# EAGLE design pqar-wirebonded-rev1 (EAGLE 9.2.2)
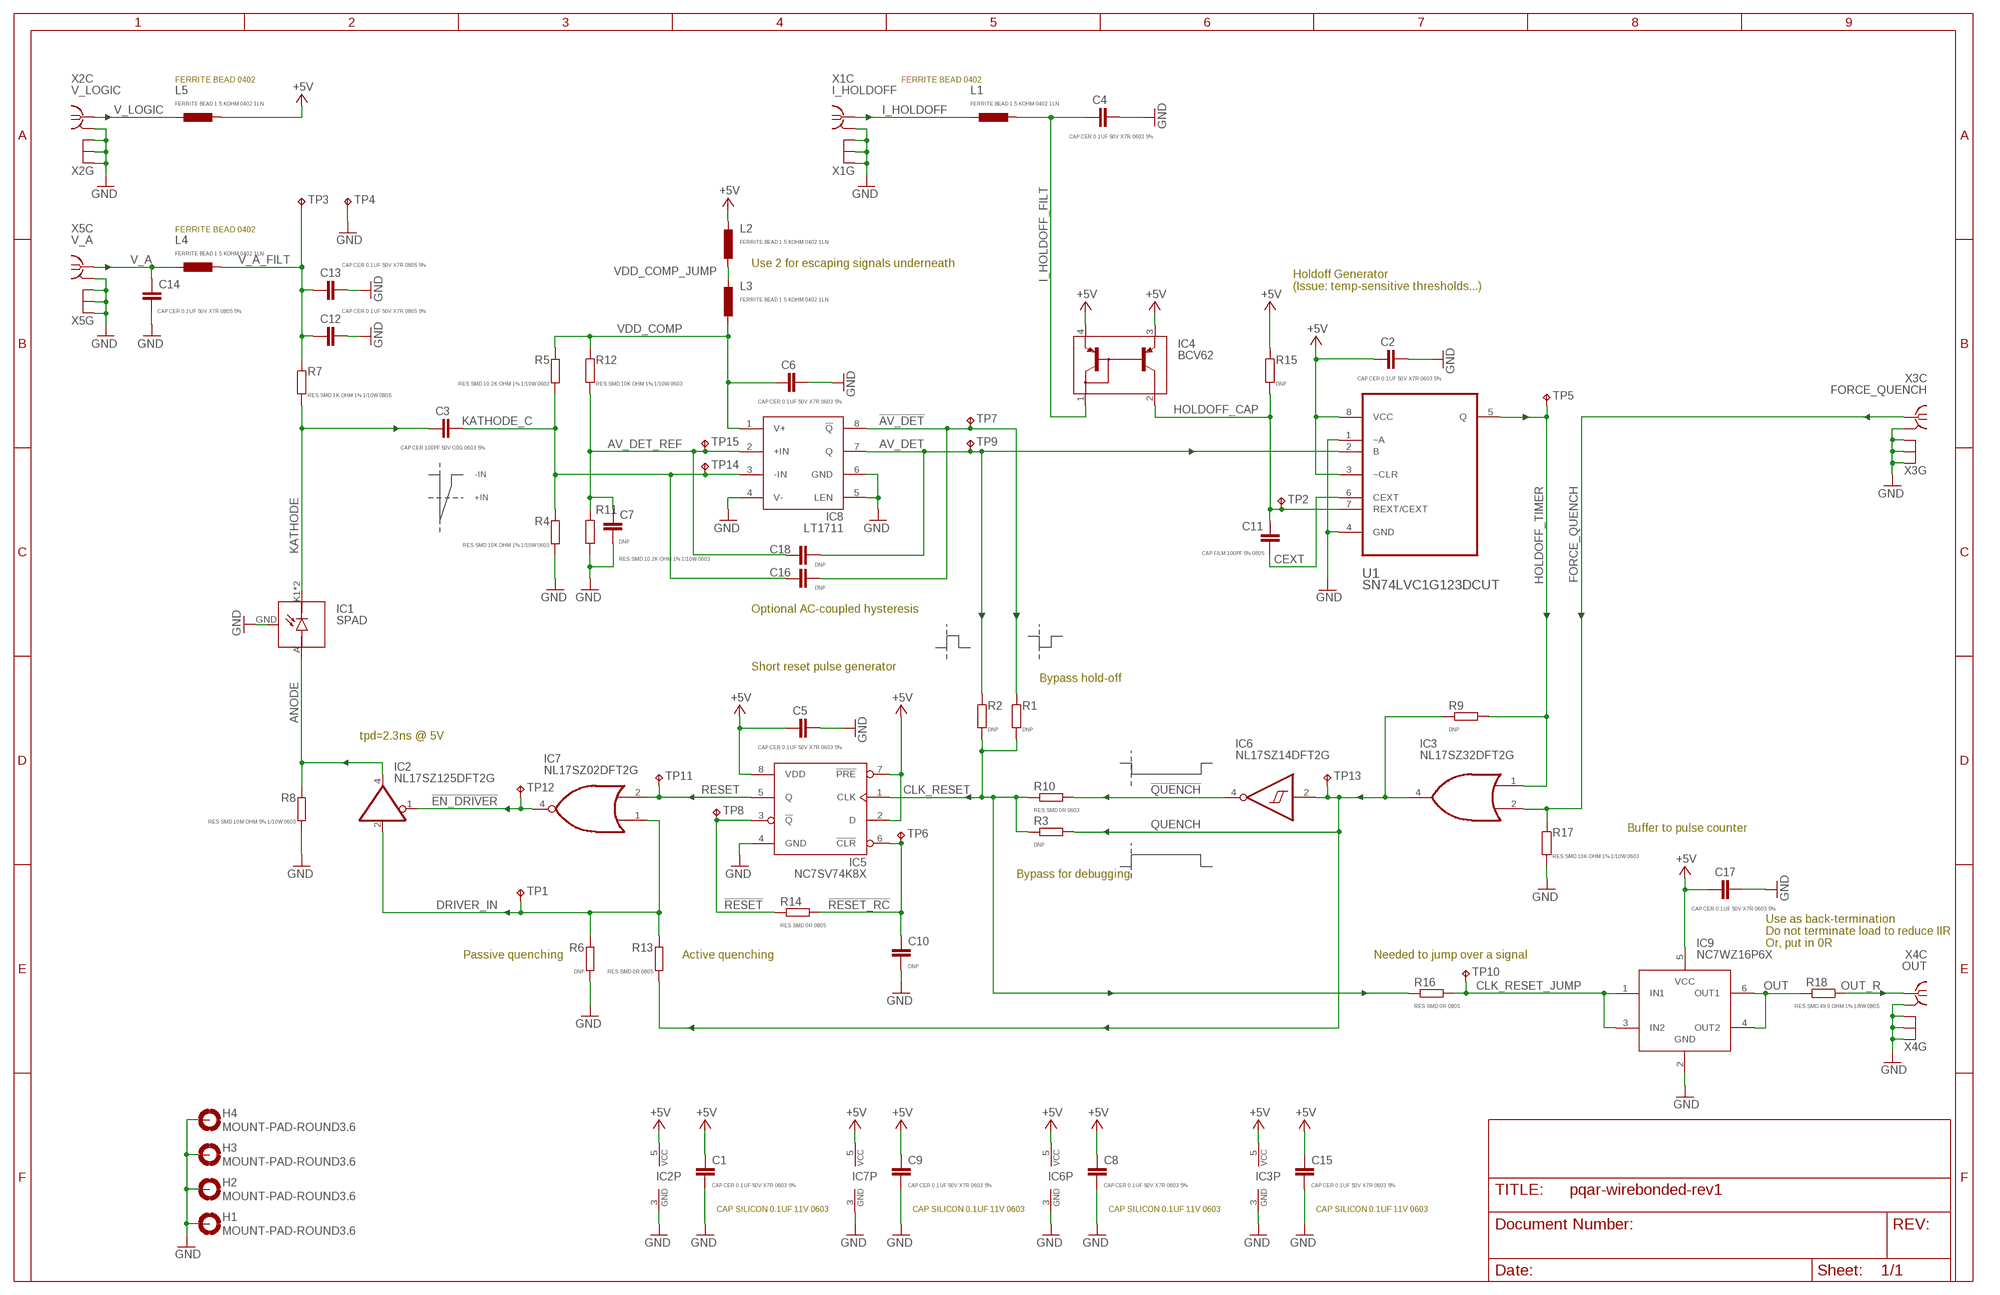
[diagram p0: schematic, sheet 1]

## Parts
C1  CAP CER 0.1UF 50V X7R 0603 5%  C-EUC0603  [C0603]
C2  CAP CER 0.1UF 50V X7R 0603 5%  C-EUC0603  [C0603]
C3  CAP CER 100PF 50V C0G 0603 5%  C-EUC0603  [C0603]
C4  CAP CER 0.1UF 50V X7R 0603 5%  C-EUC0603  [C0603]
C5  CAP CER 0.1UF 50V X7R 0603 5%  C-EUC0603  [C0603]
C6  CAP CER 0.1UF 50V X7R 0603 5%  C-EUC0603  [C0603]
C7  DNP  C-EUC0603  [C0603]
C8  CAP CER 0.1UF 50V X7R 0603 5%  C-EUC0603  [C0603]
C9  CAP CER 0.1UF 50V X7R 0603 5%  C-EUC0603  [C0603]
C10  DNP  C-EUC0805  [C0805]
C11  CAP FILM 100PF 5% 0805  C-EUC0805  [C0805]
C12  CAP CER 0.1UF 50V X7R 0805 5%  C-EUC0805  [C0805]
C13  CAP CER 0.1UF 50V X7R 0805 5%  C-EUC0805  [C0805]
C14  CAP CER 0.1UF 50V X7R 0805 5%  C-EUC0805  [C0805]
C15  CAP CER 0.1UF 50V X7R 0603 5%  C-EUC0603  [C0603]
C16  DNP  C-EUC0805  [C0805]
C17  CAP CER 0.1UF 50V X7R 0603 5%  C-EUC0603  [C0603]
C18  DNP  C-EUC0805  [C0805]
H1  MOUNT-PAD-ROUND3.6  [3,6-PAD]
H2  MOUNT-PAD-ROUND3.6  [3,6-PAD]
H3  MOUNT-PAD-ROUND3.6  [3,6-PAD]
H4  MOUNT-PAD-ROUND3.6  [3,6-PAD]
IC1  SPAD  SPAD-GENERIC  [SPAD-WIREBOND-GENERIC-CRYO]
IC2  NL17SZ125DFT2G  74AHC1G125DCK  [SC70-5]
IC3  NL17SZ32DFT2G  74AUC1G32DCK  [SC70-5]
IC4  BCV62  [SOT143B]
IC5  NC7SV74K8X  [US8_3.1MM_JDEC_MO-187]
IC6  NL17SZ14DFT2G  74AHC1G14DCK  [SC70-5]
IC7  NL17SZ02DFT2G  74LVC1G02DCK  [SC70-5]
IC8  LT1711  LTC1711  [MSOP8]
IC9  NC7WZ16P6X  [SC70-6L]
L1  FERRITE BEAD 1.5 KOHM 0402 1LN  INDUCTOR0402  [R0402]
L2  FERRITE BEAD 1.5 KOHM 0402 1LN  INDUCTOR0402  [R0402]
L3  FERRITE BEAD 1.5 KOHM 0402 1LN  INDUCTOR0402  [R0402]
L4  FERRITE BEAD 1.5 KOHM 0402 1LN  INDUCTOR0402  [R0402]
L5  FERRITE BEAD 1.5 KOHM 0402 1LN  INDUCTOR0402  [R0402]
R1  DNP  R-EU_R0805  [R0805]
R2  DNP  R-EU_R0805  [R0805]
R3  DNP  R-EU_R0603  [R0603]
R4  RES SMD 10K OHM 1% 1/10W 0603  R-EU_R0603  [R0603]
R5  RES SMD 10.2K OHM 1% 1/10W 0603  R-EU_R0603  [R0603]
R6  DNP  R-EU_R0805  [R0805]
R7  RES SMD 1K OHM 1% 1/10W 0805  R-EU_R0805  [R0805]
R8  RES SMD 10M OHM 5% 1/10W 0603  R-EU_R0603  [R0603]
R9  DNP  R-EU_R0603  [R0603]
R10  RES SMD 0R 0603  R-EU_R0603  [R0603]
R11  RES SMD 10.2K OHM 1% 1/10W 0603  R-EU_R0603  [R0603]
R12  RES SMD 10K OHM 1% 1/10W 0603  R-EU_R0603  [R0603]
R13  RES SMD 0R 0805  R-EU_R0805  [R0805]
R14  RES SMD 0R 0805  R-EU_R0805  [R0805]
R15  DNP  R-EU_R0805  [R0805]
R16  RES SMD 0R 0805  R-EU_R0805  [R0805]
R17  RES SMD 10K OHM 1% 1/10W 0603  R-EU_R0603  [R0603]
R18  RES SMD 49.9 OHM 1% 1/8W 0805  R-EU_R0805  [R0805]
TP1  AV_DET  TPTP10R  [TP10R]
TP2  AV_DET  TPTP10R  [TP10R]
TP3  AV_DET  TPTP10R  [TP10R]
TP4  AV_DET  TPTP10R  [TP10R]
TP5  AV_DET  TPTP10R  [TP10R]
TP6  AV_DET  TPTP10R  [TP10R]
TP7  AV_DET  TPTP10R  [TP10R]
TP8  AV_DET  TPTP10R  [TP10R]
TP9  AV_DET  TPTP10R  [TP10R]
TP10  AV_DET  TPTP10R  [TP10R]
TP11  AV_DET  TPTP10R  [TP10R]
TP12  AV_DET  TPTP10R  [TP10R]
TP13  AV_DET  TPTP10R  [TP10R]
TP14  AV_DET  TPTP10R  [TP10R]
TP15  AV_DET  TPTP10R  [TP10R]
U1  SN74LVC1G123DCUT  [SOP50P310X90-8N]
X1  I_HOLDOFF  MMCXBIGPAD  [MMCX-SMT-BIGPADS]
X2  V_LOGIC  MMCXBIGPAD  [MMCX-SMT-BIGPADS]
X3  FORCE_QUENCH  MMCXBIGPAD  [MMCX-SMT-BIGPADS]
X4  OUT  MMCXBIGPAD  [MMCX-SMT-BIGPADS]
X5  V_A  MMCXBIGPAD  [MMCX-SMT-BIGPADS]

## Nets
!AV_DET: C16.2 IC8.8(!Q) R1.1 TP7.TP
!EN_DRIVER: IC2.1(OE) IC7.4(O) TP12.TP
!QUENCH: IC6.4(O) R10.2
!RESET: IC5.3(!Q) R14.1 TP8.TP
!RESET_RC: C10.1 IC5.6(!CLR) R14.2 TP6.TP
+5V: C1.1 C2.1 C5.1 C8.1 C9.1 C15.1 C17.1 IC2.5(VCC) IC3.5(VCC) IC4.3(E_OUT) IC4.4(E_IN) IC5.2(D) IC5.7(!PRE) IC5.8(VDD) IC6.5(VCC) IC7.5(VCC) IC9.5(VCC) L2.1 L5.2 R15.1 U1.3(~CLR) U1.8(VCC)
ANODE: IC1.A(SPAD_ANODE) IC2.4(O) R8.1
AV_DET: C18.2 IC8.7(Q) R2.1 TP9.TP U1.2(B)
AV_DET_REF: C7.1 C18.1 IC8.2(+IN) R11.1 R12.2 TP15.TP
CEXT: C11.2 U1.6(CEXT)
CLK_RESET: IC5.1(CLK) R1.2 R2.2 R3.1 R10.1 R16.1
CLK_RESET_JUMP: IC9.1(IN1) IC9.3(IN2) R16.2 TP10.TP
DRIVER_IN: IC2.2(I) IC7.1(I0) R6.1 R13.1 TP1.TP
FORCE_QUENCH: IC3.2(I1) R17.1 X3.S
GND: C1.2 C2.2 C4.2 C5.2 C6.2 C7.2 C8.2 C9.2 C10.2 C12.2 C13.2 C14.2 C15.2 C17.2 H1.B3,6(MOUNT) H2.B3,6(MOUNT) H3.B3,6(MOUNT) H4.B3,6(MOUNT) IC1.GND IC2.3(GND) IC3.3(GND) IC5.4(GND) IC6.3(GND) IC7.3(GND) IC8.4(V-) IC8.5(LEN) IC8.6(GND) IC9.2(GND) R4.2 R6.2 R8.2 R11.2 R17.2 TP4.TP U1.1(~A) U1.4(GND) X1.G1(C:GND) X1.G2(G:GND) X1.G3(G:GND) X1.G4(G:GND) X2.G1(C:GND) X2.G2(G:GND) X2.G3(G:GND) X2.G4(G:GND) X3.G1(C:GND) X3.G2(G:GND) X3.G3(G:GND) X3.G4(G:GND) X4.G1(C:GND) X4.G2(G:GND) X4.G3(G:GND) X4.G4(G:GND) X5.G1(C:GND) X5.G2(G:GND) X5.G3(G:GND) X5.G4(G:GND)
HOLDOFF_CAP: C11.1 IC4.2(C_OUT) R15.2 TP2.TP U1.7(REXT/CEXT)
HOLDOFF_TIMER: IC3.1(I0) R9.2 TP5.TP U1.5(Q)
I_HOLDOFF: L1.1 X1.S
I_HOLDOFF_FILT: C4.1 IC4.1(BC_IN) L1.2
KATHODE: C3.1 IC1.K1(SPAD_CATHODE) IC1.K2(SPAD_CATHODE) R7.2
KATHODE_C: C3.2 C16.1 IC8.3(-IN) R4.1 R5.2 TP14.TP
OUT: IC9.4(OUT2) IC9.6(OUT1) R18.2
OUT_R: R18.1 X4.S
QUENCH: IC3.4(O) IC6.2(I) R3.2 R9.1 R13.2 TP13.TP
RESET: IC5.5(Q) IC7.2(I1) TP11.TP
V_A: C14.1 L4.1 X5.S
V_A_FILT: C12.1 C13.1 L4.2 R7.1 TP3.TP
V_LOGIC: L5.1 X2.S
VDD_COMP: C6.1 IC8.1(V+) L3.2 R5.1 R12.1
VDD_COMP_JUMP: L2.2 L3.1

## Notes on the sheet
- FERRITE BEAD 0402 | FERRITE BEAD 0402
- FERRITE BEAD 0402
- Use 2 for escaping signals underneath
- Holdoff Generator
  (Issue: temp-sensitive thresholds...)
- -IN
- +IN
- Optional AC-coupled hysteresis
- Short reset pulse generator
- Bypass hold-off
- tpd=2.3ns @ 5V
- Buffer to pulse counter
- Bypass for debugging
- Use as back-termination
  Do not terminate load to reduce IIR
  Or, put in 0R
- Passive quenching | Active quenching | Needed to jump over a signal
- CAP SILICON 0.1UF 11V 0603 | CAP SILICON 0.1UF 11V 0603 | CAP SILICON 0.1UF 11V 0603 | CAP SILICON 0.1UF 11V 0603

## Library data of the parts
C1-C18 = rcl-modified-footprints:C-EU: CAPACITOR, European symbol
H1-H4 = holes:MOUNT-PAD-ROUND: MOUNTING PAD, round
IC1 = meng:SPAD-GENERIC
IC2 = 74xx-little-de:74*1G125: Single Bus Buffer Gate with 3-State Output
IC3 = 74xx-little-us:74*1G32: 2-input OR gate
IC4 = meng:BCV62
IC5 = meng:NC7SV74K8X
IC6 = 74xx-little-us:74*1G14: Single Schmitt-Trigger Inverter Gate
IC7 = 74xx-little-us:74*1G02: 2-input NOR gate
IC8 = meng:LTC1711
IC9 = meng:NC7WZ16P6X
L1-L5 = meng:INDUCTOR
R1-R17 = rcl-modified-footprints:R-EU_: RESISTOR, European symbol
R18 = rcl:R-EU_: RESISTOR, European symbol
TP1-TP15 = testpad:TP: Test pad
U1 = Texas Instruments_By_element14_Batch_1 (2):SN74LVC1G123DCUT: SINGLE RETRIGGERABLE MONOSTABLE MULTIVIBRATOR WITH SCHMITT-TRIGGER INPUTS; MPN: SN74LVC1G123DCUT; OC_FARNELL: 1494929; OC_NEWARK: 10J9646; PACKAGE: SOP-8; SUPPLIER: Texas Instruments
X1-X5 = meng:MMCX

## Board
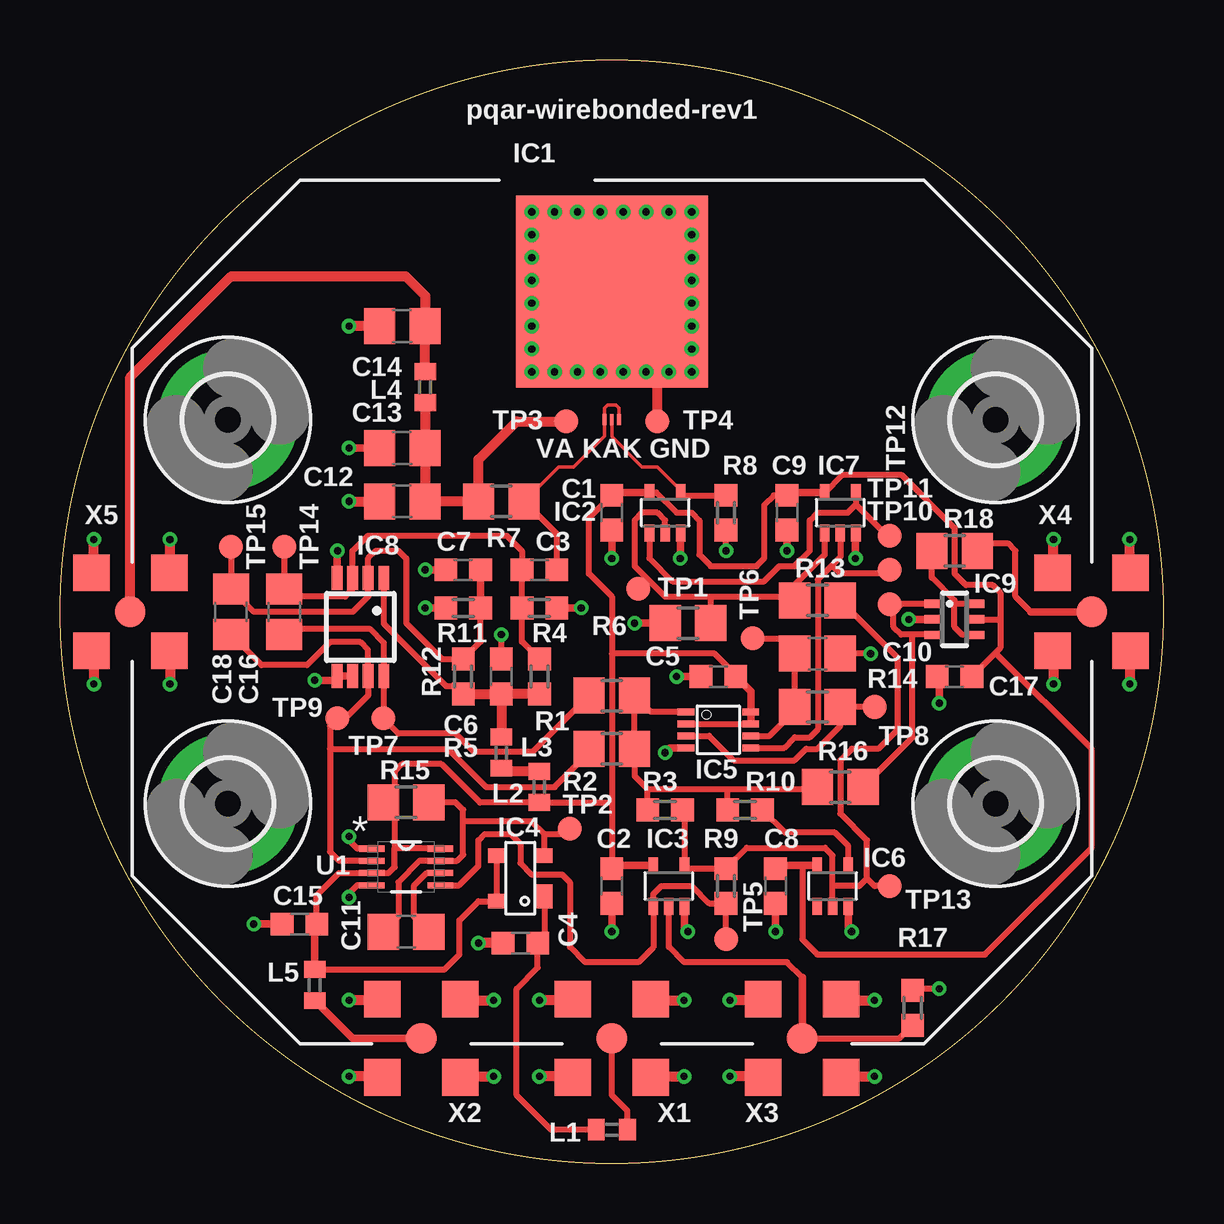
[diagram p1: board, top side]
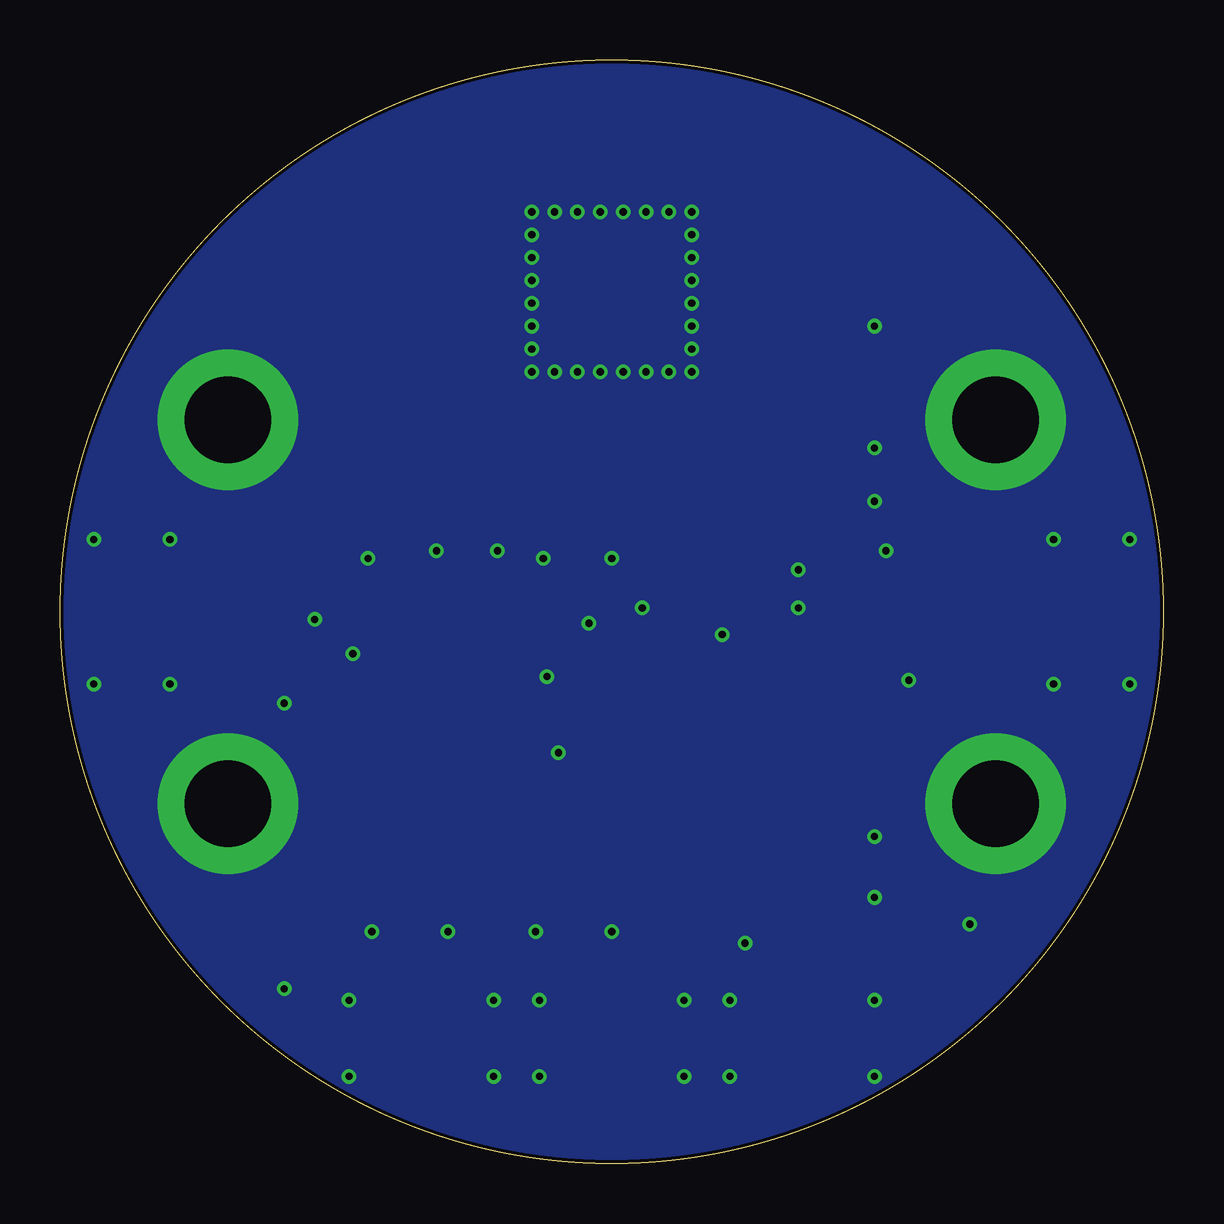
[diagram p2: board, bottom side, seen from below]

Size 46 x 46 mm. Coordinates in mm from the lower left corner, seen from the top.
Outline: circle at 23,23 radius 23
Copper layers (1*16): Top 0.035mm / dielectric 1.5mm / Bottom 0.035mm
Design rules "default *": minimum track width 6mil, minimum drill 0.2mm, track to track 6mil, track to pad 6mil, pad to pad 6mil, via to via 6mil, smd to smd 0mil, copper to edge 6mil, drill to drill 6mil, minimum pad ring 6mil, minimum via ring 6mil, stop-mask expansion 2mil, vias tented up to drill 0.1mm, thermal gap 6mil

### Footprints (pad centres in the part's own frame; a part is rotated, then mirrored left to right if it is on the bottom)
C0603 = smd 0.95 x 0.95: 1 -0.725,0; 2 0.725,0
C0805 = smd 1.3 x 1.5: 1 -0.95,0; 2 0.95,0
3,6-PAD = drill 3.6 pad 5.842: B3,6 0,0
SPAD-WIREBOND-GENERIC-CRYO = smd 0.152 x 0.457: A 0,-5.334; K1 -0.305,-5.334; K2 0.305,-5.334 | smd 8 x 8: GND 0,0
SC70-5 = smd 0.4 x 0.7: 1 -0.65,-0.85; 2 0,-0.85; 3 0.65,-0.85; 4 0.65,0.85; 5 -0.65,0.85
SOT143B = smd 1 x 0.7: 1 -0.75,-1 | smd 0.6 x 0.7: 2 0.95,-1; 3 0.95,1; 4 -0.95,1
US8_3.1MM_JDEC_MO-187 = smd 0.3 x 0.7: 1 -0.75,-1.35; 2 -0.25,-1.35; 3 0.25,-1.35; 4 0.75,-1.35; 5 0.75,1.35; 6 0.25,1.35; 7 -0.25,1.35; 8 -0.75,1.35
MSOP8 = smd 0.45 x 1: 1 -0.975,-2.05; 2 -0.325,-2.05; 3 0.325,-2.05; 4 0.975,-2.05; 5 0.975,2.05; 6 0.325,2.05; 7 -0.325,2.05; 8 -0.975,2.05
SC70-6L = smd 0.35 x 0.8: 1 -0.65,-0.85; 2 0,-0.85; 3 0.65,-0.85; 4 0.65,0.85; 5 0,0.85; 6 -0.65,0.85
R0402 = smd 0.7 x 0.9: 1 -0.65,0; 2 0.65,0
R0805 = smd 1.3 x 1.5: 1 -0.95,0; 2 0.95,0
R0603 = smd 0.95 x 0.95: 1 -0.725,0; 2 0.725,0
TP10R = smd 1 x 1: TP 0,0
SOP50P310X90-8N = smd 1.067 x 0.254: 1 -1.422,0.762; 2 -1.422,0.254; 3 -1.422,-0.254; 4 -1.422,-0.762; 5 1.422,-0.762; 6 1.422,-0.254; 7 1.422,0.254; 8 1.422,0.762
MMCX-SMT-BIGPADS = smd 1.524 x 1.524: G1 -1.626,1.626; G2 1.626,1.626; G3 1.626,-1.626; G4 -1.626,-1.626 | smd 1.27 x 1.27: S 0,0

### Placement (x,y rotation side)
C1  23,27.13 270 top
C2  23,11.57 270 top
C3  19.98,24.75 180 top
C4  19.19,9.19 180 top
C5  27.45,20.3 180 top
C6  18.4,20.3 90 top
C7  16.81,24.75 180 top
C8  29.83,11.57 270 top
C9  30.3,27.13 270 top
C10  31.57,21.25 0 top
C11  14.43,9.66 0 top
C12  14.27,27.6 180 top
C13  14.27,29.83 180 top
C14  14.27,34.91 180 top
C15  9.98,9.98 180 top
C16  9.35,23 270 top
C17  37.29,20.3 180 top
C18  7.12,23 270 top
H1  39,15 0 top
H2  7,15 0 top
H3  39,31 0 top
H4  7,31 0 top
IC1  23,36.34 0 top
IC2  25.22,27.13 0 top
IC3  25.38,11.57 0 top
IC4  19.19,11.89 90 top
IC5  27.45,18.08 270 top
IC6  32.21,11.57 0 top
IC7  32.52,27.13 0 top
IC8  12.52,22.36 180 top
IC9  37.29,22.68 270 top
L1  23,1.41 180 top
L2  19.98,15.7 90 top
L3  18.4,17.13 90 top
L4  15.22,32.37 270 top
L5  10.62,7.44 90 top
R1  23,19.51 0 top
R2  23,17.29 0 top
R3  25.22,14.74 0 top
R4  19.98,23.16 0 top
R5  19.98,20.3 90 top
R6  26.18,22.52 180 top
R7  18.4,27.6 0 top
R8  27.76,27.13 270 top
R9  27.76,11.57 270 top
R10  28.56,14.74 0 top
R11  16.81,23.16 180 top
R12  16.81,20.3 90 top
R13  31.57,23.48 0 top
R14  31.57,19.03 180 top
R15  14.43,15.06 0 top
R16  32.52,15.7 0 top
R17  35.54,6.49 90 top
R18  37.29,25.54 180 top
TP1  24.11,23.95 0 top
TP2  21.25,13.95 0 top
TP3  21.09,30.94 0 top
TP4  24.91,30.94 0 top
TP5  27.76,9.35 0 top
TP6  28.87,21.89 0 top
TP7  13.47,18.55 0 top
TP8  33.95,19.03 0 top
TP9  11.57,18.55 0 top
TP10  34.59,23.32 0 top
TP11  34.59,24.75 0 top
TP12  34.59,26.18 0 top
TP13  34.59,11.57 0 top
TP14  9.35,25.7 0 top
TP15  7.12,25.7 0 top
U1  14.43,12.36 0 top
X1  23,5.22 0 top
X2  15.06,5.22 0 top
X3  30.94,5.22 0 top
X4  43,23 0 top
X5  2.93,23 0 top

### Tracks (layer width: path | path; a pad name or v marks a point on that pad's centre or on a via)
!AV_DET
  Top 0.254: C16.2 9.57,22.27 12.93,22.27 13.5,21.71 IC8.8 13.5,18.58 TP7.TP 14.11,17.92 16.49,17.92 17.26,17.15 19.69,17.15 R1.1
!EN_DRIVER
  Top 0.254: IC2.1 24.57,25.24 25.54,24.27 29.35,24.27 29.98,24.91 30.62,24.91 31.26,25.54 31.26,26.81 31.57,27.13 32.84,27.13 33.17,27.46 | IC7.4 33.17,27.46 | TP12.TP 34.46,26.18 33.17,27.46
!QUENCH
  Top 0.254: IC6.4 32.86,13.23 32.3,13.79 30.23,13.79 R10.2
!RESET
  Top 0.254: IC5.3 27.06,17.83 28.08,16.81 30.62,16.81 31.1,17.29 31.57,17.29 32.52,18.23 R14.1 TP8.TP
!RESET_RC
  Top 0.254: IC5.6 29.58,17.83 30.62,18.88 R14.2 C10.1 29.99,21.89 TP6.TP
+5V
  Top 0.254: C15.1 10.71,11.18 11.63,12.11 U1.3 13.7,12.11 13.95,12.36 13.95,13.16 | IC4.3 IC4.4 17.45,10.94 16.65,10.14 16.65,8.71 16.03,8.09 L5.2 | IC5.2 IC5.7 | 30.94,12.42 30.94,9.35 31.57,8.71 38.56,8.71 43,13.16 43,17.29 39,21.29 | IC2.5 24.85,27.98 25.7,27.13 26.33,27.13 26.65,26.81 26.65,25.38 27.13,24.91 29.03,24.91 29.35,25.22 29.35,27.45 29.76,27.85 C9.1 | IC7.5 32.61,28.71 35.06,28.71 37.29,26.49 37.29,24.59 37.76,24.11 38.88,24.11 39.19,23.79 39.19,22.68 | C5.1 28.17,20.37 27.29,21.25 23,21.25 | 23.12,27.98 22.05,26.9 22.05,24.59 23,23.64 23,21.25 | 23,21.25 23,15.06 | 23,15.06 23,12.54 23.12,12.42 | 23,15.06 22.98,15.05 L2.1 17.5,15.05 15.9,16.65 14.27,16.65 13.95,16.33 13.95,15.54 R15.1 13.95,14.59 13.95,13.16 | U1.8 13.98,13.13 13.95,13.16 | 39,21.29 39.19,21.48 39.19,22.68 | 39,21.29 C17.1 | IC9.5 39.19,22.68
  Top 0.305: IC7.5 30.43,27.98 C9.1 | IC2.5 23.12,27.98 C1.1 | L5.2 10.62,9.89 C15.1 | IC5.7 IC5.8 28.8,19.68 C5.1 | IC3.5 23.12,12.42 C2.1 | IC6.5 30.94,12.42 29.95,12.42 C8.1
ANODE
  Top 0.152: IC1.A 23,30.3 24.27,29.03 24.91,29.03 25.87,28.07 IC2.4
  Top 0.254: IC2.4 26,27.85 R8.1
AV_DET
  Top 0.254: U1.2 11.63,12.62 11.25,13 11.25,17.29 | 11.25,17.29 11.25,18.24 TP9.TP 11.89,18.55 12.85,19.52 IC8.7 12.84,20.46 12.84,21.41 12.52,21.73 11.25,21.73 10.3,20.78 8.4,20.78 C18.2 | 11.25,17.29 16.17,17.29 17.76,15.7 20.62,15.7 22.05,17.13 R2.1
AV_DET_REF
  Top 0.254: R11.1 17.53,21.75 R12.2 15.93,21.03 14.43,22.52 14.43,25.22 14.11,25.54 13.16,25.54 12.85,25.23 IC8.2 12.85,23.64 12.21,23 8.07,23 C18.1 TP15.TP
  Top 0.305: C7.1 R11.1
CEXT
  Top 0.254: U1.6 15.29,12.11 14.74,11.57 14.74,10.3 C11.2
CLK_RESET
  Top 0.254: 24.5,15.61 23.95,16.16 R2.2 R1.2 24.63,18.83 IC5.1 | R3.1 24.5,15.61 | 24.5,15.61 27.76,15.61 | 27.76,15.61 31.48,15.61 R16.1 | R10.1 27.83,15.54 27.76,15.61
CLK_RESET_JUMP
  Top 0.254: IC9.1 35.08,23.33 34.83,23.08 | 34.83,23.08 34.75,23 34.75,22.36 35.06,22.05 35.54,22.05 | IC9.3 36.42,22.05 35.54,22.05 | TP10.TP 34.83,23.08 | R16.2 35.54,17.76 35.54,22.05
DRIVER_IN
  Top 0.254: 24.51,24.35 23.95,24.91 23.95,26.81 24.27,27.13 24.91,27.13 25.22,26.81 IC2.2 | 24.51,24.35 25.22,23.64 27.12,23.64 | R13.1 30.46,23.64 27.29,23.64 27.13,23.64 27.12,23.64 | R13.1 | IC7.1 31.87,25.37 30.62,24.12 R13.1 | R6.1 27.12,23.64 | TP1.TP 24.51,24.35
FORCE_QUENCH
  Top 0.254: 30.94,7.76 30.3,8.39 26.02,8.39 25.38,9.03 IC3.2 | X3.S 35,5.22 R17.1
  Top 0.305: X3.S 30.94,7.76
GND  (via drill 0.3)
  Top 0.254: U1.1 12.4,13.13 12.05,13.47 v12.05,13.63 | U1.4 12.4,11.6 12.05,11.25 v12.05,11.09 | C6.2 v18.4,22.05 | v27.76,25.54 R8.2 | IC1.GND v19.67,33 | v33.8,21.25 C10.2 | v36.65,7.28 35.61,7.28 R17.2
  Top 0.305: IC2.3 25.87,25.24 v25.86,25.22 | C1.2 v23,25.22 | v15.22,24.75 C7.2 | v15.22,23.16 R11.2 | v10.62,20.14 11.38,20.14 IC8.5 IC8.6 | v11.57,25.54 11.55,25.52 IC8.4 | C13.2 v12.05,29.83 | C9.2 v30.3,25.54 | IC7.3 33.16,26.26 v33.16,25.22 | R4.2 v21.73,23.16 | C15.2 v8.08,9.98 | IC5.4 25.43,17.33 v25.22,17.13 | C5.2 v25.7,20.3 | IC9.2 v35.38,22.68 | R6.2 v23.95,22.52 | C2.2 v23,9.66 | C17.2 36.65,20.21 v36.65,19.19 | IC3.3 26.03,9.81 v26.18,9.66 | C8.2 v29.83,9.66 | IC6.3 32.86,9.81 v33,9.66
  Top 0.406: C14.2 v12.05,34.91 | X5.G1 1.41,24.73 v1.41,26.02 | X5.G2 4.59,24.65 v4.59,26.02 | X5.G3 4.59,21.35 v4.59,19.98 | X5.G4 1.41,21.27 v1.41,19.98 | X1.G3 24.66,3.63 v26.02,3.63 | X1.G2 24.66,6.81 v26.02,6.81 | X1.G1 21.34,6.81 v19.98,6.81 | X1.G4 21.34,3.63 v19.98,3.63 | X3.G3 32.6,3.63 v33.95,3.63 | X3.G2 32.6,6.81 v33.95,6.81 | X3.G1 29.27,6.81 v27.92,6.81 | X3.G4 29.27,3.63 v27.92,3.63 | X2.G3 16.73,3.63 v18.08,3.63 | X2.G2 16.73,6.81 v18.08,6.81 | X2.G4 13.4,3.63 v12.05,3.63 | X2.G1 13.4,6.81 v12.05,6.81 | X4.G4 41.41,21.34 v41.41,19.98 | X4.G3 44.59,21.34 v44.59,19.98 | X4.G1 41.41,24.66 v41.41,26.02 | X4.G2 44.59,24.66 v44.59,26.02 | v12.05,27.6 C12.2 | C4.2 v17.44,9.19 | TP4.TP 24.91,34.43 IC1.GND
  other vias: 26.33,33 21.57,33 19.67,39.67 20.62,39.67 20.62,33 21.57,39.67 22.52,39.67 24.43,39.67 23.48,39.67 25.38,39.67 26.33,39.67 22.52,33 23.48,33 24.43,33 25.38,33 26.33,38.72 26.33,37.76 26.33,36.81 26.33,35.86 26.33,34.91 26.33,33.95 19.67,33.95 19.67,34.91 19.67,35.86 19.67,36.81 19.67,37.76 19.67,38.72
  pour Bottom (no thermals): -7.48,-7.48 53.48,-7.48 53.48,53.48 -7.48,53.48
HOLDOFF_CAP
  Top 0.254: C11.1 14.11,10.3 14.11,11.73 15,12.62 U1.7 16.56,12.62 16.81,12.87 16.81,14.27 | 16.81,14.27 16.81,14.74 16.49,15.06 R15.2 | IC4.2 20.19,13.74 | 20.19,13.74 19.67,14.27 16.81,14.27 | 20.19,13.74 21.05,13.74 TP2.TP
HOLDOFF_TIMER
  Top 0.254: U1.5 16.64,11.6 17.44,12.41 17.44,13.47 17.7,13.73 18.77,13.73 19.19,13.32 19.19,12.52 19.67,12.05 20.94,12.05 21.25,11.73 21.25,9.03 21.89,8.39 24.11,8.39 24.73,9.02 IC3.1 24.73,11.24 25.06,11.57 26.33,11.57 27.06,10.85 R9.2 TP5.TP
I_HOLDOFF
  Top 0.254: L1.1 23.65,2.2 23,2.85 X1.S
I_HOLDOFF_FILT
  Top 0.254: L1.2 20.46,1.41 19.03,2.84 19.03,7.28 19.91,8.17 C4.1 20.19,9.46 IC4.1
KATHODE
  Top 0.152: IC1.K2 23.3,31.48 23.17,31.62 22.83,31.62 22.7,31.48 IC1.K1 22.7,30.32 21.41,29.03 20.78,29.03 19.43,27.68 19.43,27.52
  Top 0.254: C3.1 20.71,26.24 19.43,27.52 R7.2
KATHODE_C
  Top 0.254: R5.2 19.26,21.75 R4.1 C3.2 19.26,25.54 18.62,26.18 12.84,26.18 12.2,25.53 IC8.3 12.2,23.95 11.89,23.64 9.66,23.64 C16.1 TP14.TP
OUT
  Top 0.254: IC9.4 37.62,22.03 37.29,22.36 37.29,23.32 | 37.29,23.32 37.29,23.48 36.34,24.43 R18.2 | IC9.6 38.12,23.32 37.29,23.32
OUT_R
  Top 0.254: 40.46,23 39.83,23.64 39.83,25.54 39.51,25.86 38.24,25.86 R18.1
  Top 0.305: X4.S 40.46,23
QUENCH
  Top 0.254: IC6.2 32.21,11.57 | 32.21,11.57 32.21,12.84 31.89,13.16 28.62,13.16 R9.1 26.16,12.29 IC3.4 26.03,14.67 R3.2 | 33.64,11.89 33.32,11.57 32.21,11.57 | 33.64,11.89 33.64,13.47 32.52,14.59 32.52,16.81 33,17.29 34.11,17.29 34.91,18.08 34.91,21.09 R13.2 | TP13.TP 33.95,11.57 33.64,11.89
RESET
  Top 0.254: 32.18,24.93 32.52,25.27 IC7.2 | 32.18,24.93 31.59,24.34 31.59,18.1 31.26,17.76 30.62,17.76 30.19,17.33 IC5.5 | TP11.TP 34.43,24.59 32.52,24.59 32.18,24.93
V_A
  Top 0.406: L4.1 C14.1 | C14.1 | X5.S 2.93,32.78 7.14,36.98 14.41,36.98 15.22,36.18 C14.1
V_A_FILT
  Top 0.406: L4.2 C13.1 C12.1 R7.1 17.45,29.35 19.03,30.94 TP3.TP
V_LOGIC
  Top 0.305: X2.S 12.19,5.22 L5.1
VDD_COMP
  Top 0.254: IC8.1 13.5,22.5 16.11,19.89 16.81,19.89 R12.1 | C6.1 18.4,19.73
  Top 0.406: L3.2 18.4,19.73 18.55,19.58 R5.1 | R12.1 C6.1
VDD_COMP_JUMP
  Top 0.406: L2.2 18.52,16.35 L3.1

### Text on the board
tPlace: pqar-wirebonded-rev1 | VA KAK GND